# Altium project Customized Battery Management System - Load Sharing.PrjPcb
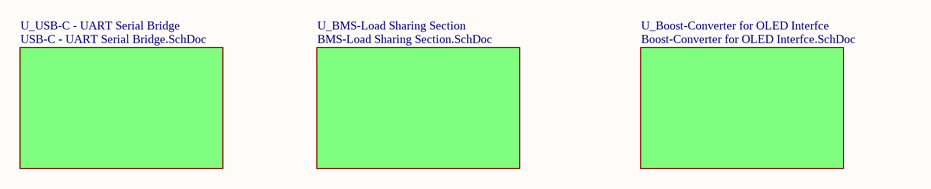
[diagram p0: Customized Battery Management System - Load Sharing System.SchDoc]
5 sheets, 33 parts. Net scope: global (net labels, ports and power ports of the same name join across sheets).
Board file: Customized Battery Management System - Load Sharing System.PcbDoc
Sheets:
  Customized Battery Management System - Load Sharing System.SchDoc
    U_BMS-Load Sharing Section = BMS-Load Sharing Section.SchDoc
    U_USB-C - UART Serial Bridge = USB-C - UART Serial Bridge.SchDoc
    U_Boost-Converter for OLED Interfce = Boost-Converter for OLED Interfce.SchDoc
  Funtional Block Diagram Power Section.SchDoc

## Sheet Customized Battery Management System - Load Sharing System.SchDoc
size A4; SheetNumber: 1; SheetTotal: 5

### Sub-sheets
U_BMS-Load Sharing Section = BMS-Load Sharing Section.SchDoc: no entries
U_Boost-Converter for OLED Interfce = Boost-Converter for OLED Interfce.SchDoc: no entries
U_USB-C - UART Serial Bridge = USB-C - UART Serial Bridge.SchDoc: no entries

## Sheet BMS-Load Sharing Section.SchDoc
size A4; SheetNumber: 3; SheetTotal: 5
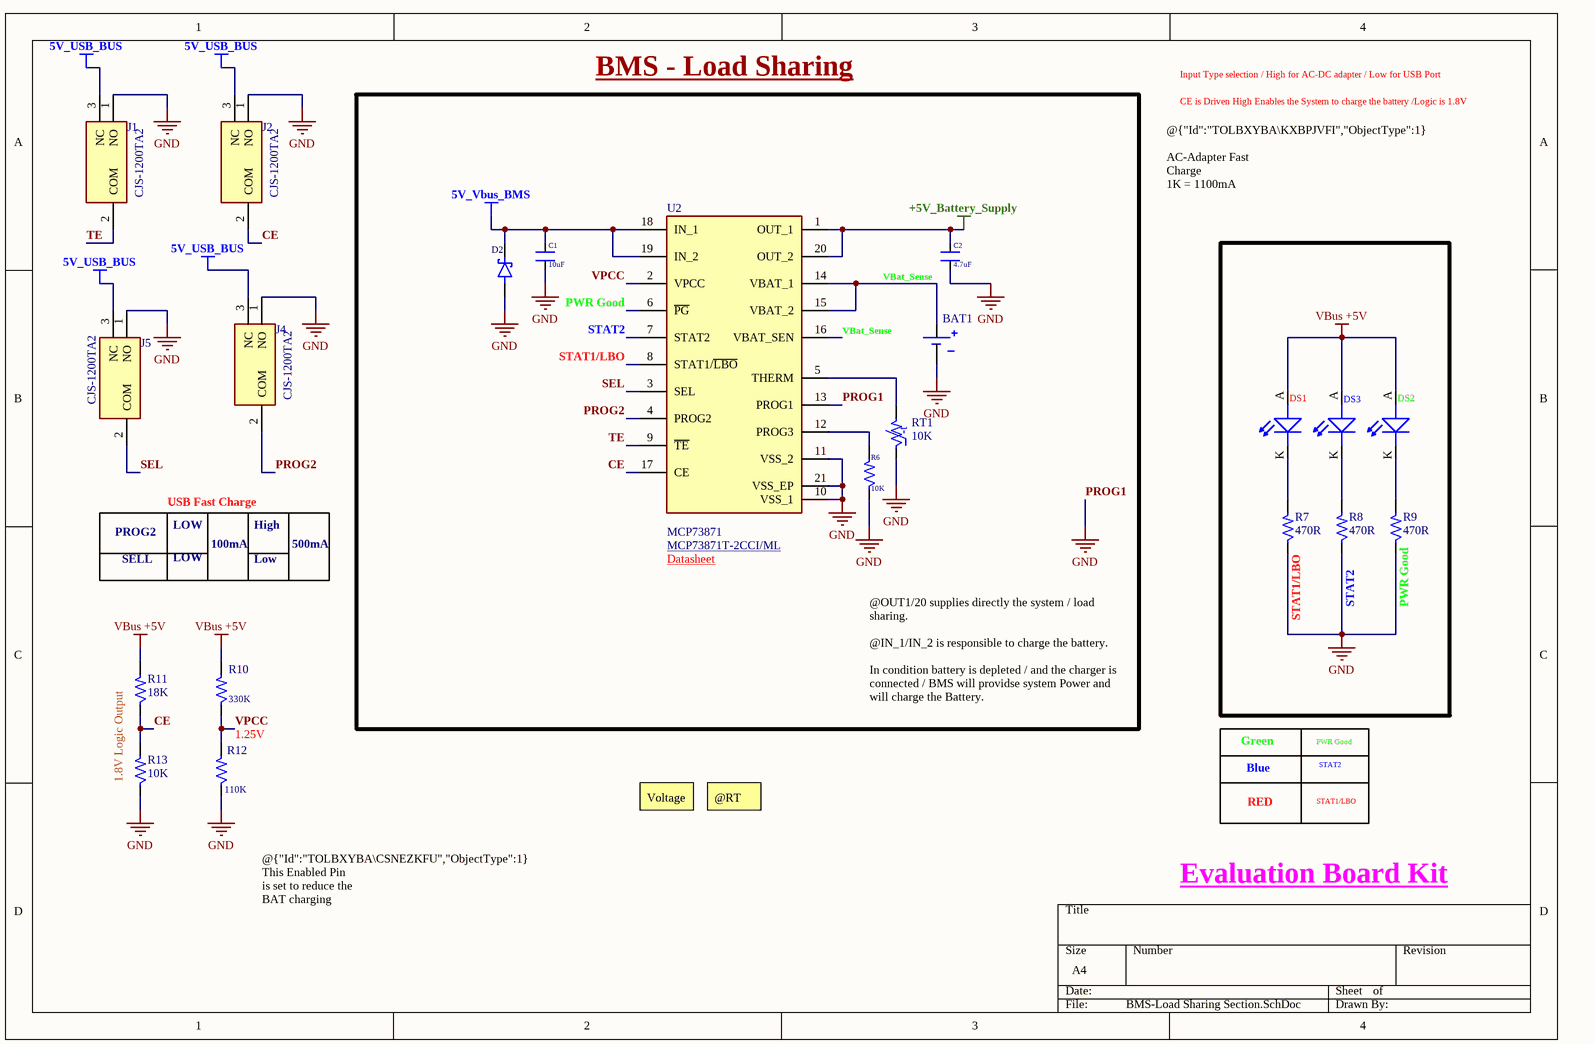
[diagram p1: BMS-Load Sharing Section.SchDoc]

### Parts
BAT1  COM-2292  [BAT_761_TH]  (value not drawn)
C1  10uF  [RES_0603]
C2  4.7uF  [RES_0603]
D2  (no value)  [SMC (DO-214AB)]
DS1  RED  [LED_0805]
DS2  GREEN LED  [LED_0805]  (value not drawn)
DS3  BLUE LED  [LED_0805]  (value not drawn)
J1  CJS-1200TA2  [CJS1200TA2]
J2  CJS-1200TA2  [CJS1200TA2]
J4  CJS-1200TA2  [CJS1200TA2]
J5  CJS-1200TA2  [CJS1200TA2]
R6  10K  [RES_0603]
R7  470R  [RES_0805]
R8  470R  [RES_0805]
R9  470R  [RES_0805]
R10  330K  [RES_0603]
R11  18K  [RES_0805]
R12  110K  [RES_0603]
R13  10K  [RES_0603]
RT1  10K  [RES_0805]
U2  MCP73871  [QFN50P400X400X100-21N-D]

### Blocks framed on the sheet
BMS - Load Sharing: BAT1 C1 C2 D2 R6 RT1 U2

### Nets
5V_USB_BUS: J1.3(NC) J2.3(NC) J4.3(NC) J5.3(NC)
5V_Vbus_BMS: C1.2 D2.C(K) U2.18(IN_1) U2.19(IN_2)
+5V_Battery_Supply: C2.2 U2.1(OUT_1) U2.20(OUT_2)
GND: BAT1.2(NEG) C1.1 C2.1 D2.A J1.1(NO) J2.1(NO) J4.1(NO) J5.1(NO) R6.1 R7.1 R8.1 R9.1 R12.1 R13.1 RT1.1 U2.6(~{PG}) U2.7(STAT2) U2.8(STAT1/~{LBO}) U2.10(VSS_1) U2.11(VSS_2) U2.13(PROG1) U2.21(VSS_EP)  [also labelled PROG1, PWR Good, STAT1/LBO, STAT2]
VBus +5V: DS1.A(ANODE) DS2.A(ANODE) DS3.A(ANODE) R10.2 R11.2
CE: J2.2(COM) R11.1 R13.2 U2.17(CE)
PROG2: J4.2(COM) U2.4(PROG2)
SEL: J5.2(COM) U2.3(SEL)
TE: J1.2(COM) U2.9(~{TE})
VBat_Sense: BAT1.1(POS) U2.14(VBAT_1) U2.15(VBAT_2) U2.16(VBAT_SEN)
VPCC: R10.1 R12.2 U2.2(VPCC)
NetDS1_K: DS1.K(CATHODE) R7.2
NetDS2_K: DS2.K(CATHODE) R9.2
NetDS3_K: DS3.K(CATHODE) R8.2
NetR6_2: R6.2 U2.12(PROG3)
NetRT1_2: RT1.2 U2.5(THERM)

### Notes on the sheet
- Input Type selection / High for AC-DC adapter / Low for USB Port
- CE is Driven High Enables the System to charge the battery /Logic is 1.8V
- @{"Id":"TOLBXYBA\KXBPJVFI","ObjectType":1}
  AC-Adapter Fast Charge
  1K = 1100mA
  10K = 110mA
- USB Fast Charge
- LOW
- High
- PROG2
- SELL
- 100mA
- Low
- 500mA
- Datasheet <https://ww1.microchip.com/downloads/en/DeviceDoc/MCP73871-Data-Sheet-20002090E.pdf>
- (near U2) MCP73871T-2CCI/ML <https://au.mouser.com/ProductDetail/Microchip-Technology/MCP73871T-2CCI-ML?qs=qXsUupcbpXwuQ8z0ISUvDA%3D%3D>
- @OUT1/20 supplies directly the system / load sharing.
  @IN_1/IN_2 is responsible to charge the battery.
  In condition battery is depleted / and the charger is connected / BMS will providse system Power and will charge the Battery.
- 1.8V Logic Output
- 1.25V
- Green
- Blue
- PWR Good
- STAT2
- Voltage Proportional Charge
  Control (VPCC)
  If the voltage on the IN pin drops to a preset value
  determined by the threshold established at the VPCC
  input due to a limited amount of input current or input
  source impedance, the battery charging current is
  reduced. If possible, further demand from the system is
  supported by the battery. To enable this feature, simply
  supply 1.23V or greater to the VPCC pin. This feature
  can be disabled by connecting the VPCC pin to IN.
  For example, a system is designed with a 5.5V rated
  DC power supply with ±0.5V tolerance. The worst
  condition of 5V is selected, which is used to calculate
  the VPCC supply voltage with divider.
- @RT THERM
  The MCP73871 device continuously monitors battery
  temperature during a charge cycle by measuring the
  voltage between the THERM and VSS pins. An internal
  50 μA current source provides the bias for most
  common 10 k NTC or Positive Temperature Coefficient (PTC) thermistors.The current source is
  controlled, avoiding measurement sensitivity to fluctuations in the supply voltage (VDD). The MCP73871
  device compares the voltage at the THERM pin to factory set thresholds of 1.24V and 0.25V, typically. Once
  a voltage outside the thresholds is detected during a
  charge cycle, the MCP73871 device immediately
  suspends the charge cycle.
- STAT1/LBO
- @{"Id":"TOLBXYBA\CSNEZKFU","ObjectType":1}
  This Enabled Pin is set to reduce the BAT charging when the Input impedance is high so the source current is prioritized for the System Load.
- Evaluation Board Kit <https://ww1.microchip.com/downloads/aemDocuments/documents/OTH/ProductDocuments/UserGuides/51755a.pdf>
- (in symbol RT_10K-0805) -t

### Library data of the parts
BAT1 = BAT_787-TH: Basic 20mm coin cell holder. Posts can be inserted into 0.1" perf board! Holds the common CR2032 type batteries.; Manufacturer: NA; Manufacturer Part Number: NA; Case/Package: TH; Supplier-1: Rhydo Labs; Supplier Part Number-1: COM-2292; Alternate Part Number-1: NA
C1 C2 = CAP_GENERIC_0603_1: Ceramic Capacitor C0G, NP0 0603 (2012 Metric); Manufacturer: Yageo; Manufacturer Part Number: 600F1R0BT250XT; Alternate Part Number-1: NA; Case/Package: 0805; Supplier-1: Mouser; Supplier Part Number-1: 581-600F1R0BT
D2 = DIO - Diode Schottky 40 V 3A Surface Mount SMC (DO-214AB)  SS34: Diode Schottky 40 V 3A Surface Mount SMC (DO-214AB)
DS1 = LED_RED-2V-20mA-0805: Red 631nm LED Indication - Discrete 2V 0805 (2012 Metric); Manufacturer: Vishay Lite-On; Manufacturer Part Number: LTST-C171KRKT; Alternate Part Number-1: NA; Case/Package: 0805; Supplier-1: SP ROAD; Supplier Part Number-1: LTST-C171KRKT
DS2 = LED_GREEN-2.2-20mA-0805: Green 569nm LED Indication - Discrete 2.1V 0805 (2012 Metric); Manufacturer: Vishay Lite-On; Manufacturer Part Number: LTST-C171GKT; Alternate Part Number-1: NA; Case/Package: 0805; Supplier-1: SP ROAD; Supplier Part Number-1: LTST-C171GKT
DS3 = LED_BLUE-3V3-20mA-0805: Blue 470nm LED Indication - Discrete 3.3V 0805 (2012 Metric); Manufacturer: Vishay Lite-On; Manufacturer Part Number: LTST-C171TBKT; Alternate Part Number-1: NA; Case/Package: 0805; Supplier-1: SP ROAD; Supplier Part Number-1: LTST-C171TBKT
J1 J2 J4 J5 = Switches Slide 1 Pole, 2 Contacts, SPDT Top Setting SMD Slide Switch: Slide Switches 1 Pole, 2 Contacts, SPDT Top Setting SMD Slide Switch
R6 R10 R12 R13 = RES_10K-0.1W-1%-0603: 10 kOhms ±1% 0.1W, 1/10W Chip Resistor 0603 (1608 Metric) Automotive AEC-Q200 Thick Film; Manufacturer: Walsin; Manufacturer Part Number: WR06X1002FTL; Alternate Part Number-1: 0603WAJ0103T5E; Case/Package: 0603; Supplier-1: SIRICOM; Supplier Part Number-1: WR06X1002FTL
R7-R9 = RES_470R-0.125W-1%-0805: 470 Ohms ±1% 0.125W, 1/8W Chip Resistor 0805 (2012 Metric) Automotive AEC-Q200 Thick Film; Manufacturer: Walsin; Manufacturer Part Number: WR08X4700FTL; Alternate Part Number-1: NA; Case/Package: 0805; Supplier-1: SIRICOM; Supplier Part Number-1: WR08X4700FTL
R11 = RES_18K-0.125W-1%-0805: 18 kOhms ±1% 0.125W, 1/8W Chip Resistor 0805 (2012 Metric) Thick Film; Manufacturer: TE Connectivity Passive Product; Manufacturer Part Number: CRG0805F18K; Alternate Part Number-1: NA; Case/Package: 0805; Supplier-1: SIRICOM; Supplier Part Number: NA; Supplier Part Number-1: NA
RT1 = RT_10K-0805: NTC Thermistor 10k 0805 (2012 Metric); Manufacturer: Vishay BCcomponents; Manufacturer Part Number: NCP21XV103J03RA; Alternate Part Number-1: NA; Case/Package: 0805; Supplier-1: ARROW; Supplier Part Number-1: NCP21XV103J03RA
U2 = IC-MCP73871 Battery Management System: Stand-Alone System Load Sharing and Li-Ion/Li-Polymer Battery Charge / Management Controller

## Sheet USB-C - UART Serial Bridge.SchDoc
size A4; SheetNumber: 2; SheetTotal: 5
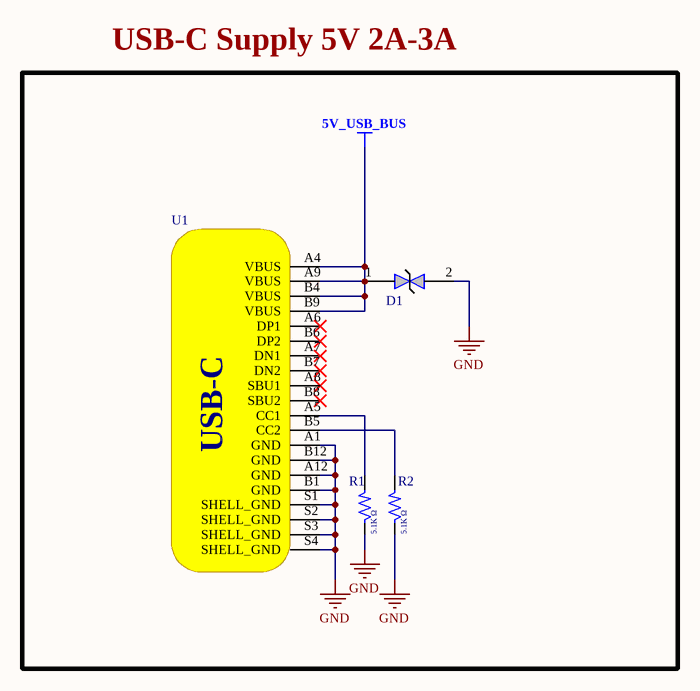
[diagram p2: USB-C - UART Serial Bridge.SchDoc]

### Parts
D1  PESD3V3L1BA,  [Nexperia_SOD323_0]  (value not drawn)
R1  5.1K Ω  [RES_0603]
R2  5.1K Ω  [RES_0603]
U1  C393939  [USB-C 16Pin]  (value not drawn)

### Blocks framed on the sheet
USB-C Supply 5V 2A-3A: D1 R1 R2 U1

### Nets
5V_USB_BUS: D1.1 U1.A4(VBUS) U1.A9(VBUS) U1.B4(VBUS) U1.B9(VBUS)
GND: D1.2 R1.1 R2.1 U1.A1(GND) U1.A12(GND) U1.B1(GND) U1.B12(GND) U1.S1(SHELL_GND) U1.S2(SHELL_GND) U1.S3(SHELL_GND) U1.S4(SHELL_GND)
NetR1_2: R1.2 U1.A5(CC1)
NetR2_2: R2.2 U1.B5(CC2)

Not connected (* = marked no-connect by the designer): U1 A6(DP1)* A7(DN1)* A8(SBU1)* B6(DP2)* B7(DN2)* B8(SBU2)*

### Notes on the sheet
- (in symbol USB-C 16Pin) USB-C

### Library data of the parts
D1 = DIO_TVS_PESD3V3L1BA,115
R1 R2 = RES_82K-0.1W-1%-0603: 82 kOhms ±1% 0.125W, 1/8W Chip Resistor 0603 (1608 Metric) Anti-Sulfur Thin Film; Manufacturer: Vishay Beyschlag; Manufacturer Part Number: MCT06030C8202FP500; Alternate Part Number-1: NA; Case/Package: 0603; Supplier-1: SIRICOM; Supplier Part Number-1: NA
U1 = USB-C 16Pin: USB-C (USB TYPE-C) Receptacle Connector 16 Position Surface Mount, Right Angle; Manufacturer: SHOU HAN; Manufacturer PN: N/A; Supplier  PN: C393939; Supplier: LCSC

## Sheet Boost-Converter for OLED Interfce.SchDoc
size A4; SheetNumber: 4; SheetTotal: 5
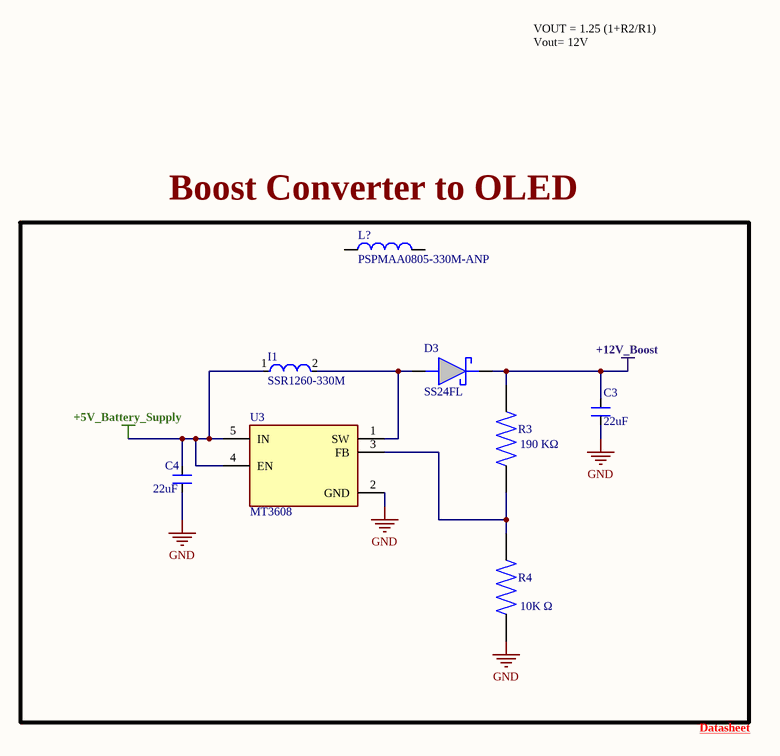
[diagram p3: Boost-Converter for OLED Interfce.SchDoc]

### Parts
C3  22uF  [RES_0603]
C4  22uF  [RES_0603]
D3  SS24FL  [Diode SS24FL]
I1  SSR1260-330M  [IND_33uH_60m_Ohm_3A]
L?  PSPMAA0805-330M-ANP  [IND 8.5x8mm]
R3  ERJU03J106V  [RES 0603 Panasonic]  (value not drawn)
R4  ERJU03J106V  [RES 0603 Panasonic]  (value not drawn)
U3  MT3608  [SOT95P280X145-6N]

### Nets
+5V_Battery_Supply: C4.2 I1.1 U3.4(EN) U3.5(IN)
+12V_Boost: C3.2 D3.C R3.2
GND: C3.1 C4.1 R4.1 U3.2(GND)
NetD3_A: D3.A I1.2 U3.1(SW)
NetR3_1: R3.1 R4.2 U3.3(FB)

Not connected (* = marked no-connect by the designer): L? 1 2

### Notes on the sheet
- VOUT = 1.25 (1+R2/R1)
  Vout= 12V
- (near R3) 190 KΩ
- (near R4) 10K Ω
- Datasheet <https://www.lcsc.com/datasheet/C84817.pdf>
- Labels drawn without touching a wire or pin: Boost Converter to OLED

### Library data of the parts
C3 C4 = CAP_GENERIC_0603_1: as C1 on sheet BMS-Load Sharing Section; Case/Package: 0805; Supplier-1: Mouser; Supplier Part Number-1: 581-600F1R0BT
D3 = DIO - Schottky Diodes & Rectifiers 40V 2A: Schottky Diodes & Rectifiers 40V, 2A SCHOTTKY
I1 = IND_33uH_60m_Ohm_3A: IND FIXED IND 33UH 3A 60 MOHM SMD; Manufacturer: BOURNS; Manufacturer  PN: SRR1260-330M; Supplier: LCSC; Supplier  PN: C840528
L? = IND-33uH 111m Ohm 6A: 3.5A 33uH 111mΩ 6A ±20% SMD,8.5x8mm Fixed Inductors RoHS
R3 R4 = RES 0603 Panasonic: 0201 anti-sulfurated resistor 0603 Anti-Sulfurated
U3 = IC- Dc-Dc Boost converter: The MT3608 is a constant frequency, 6-pin SOT23 / current mode step-up converter intended for small, / low power applications.; Manufacturer: AEROSEMI; Manufacturer  PN: MT3608; Supplier: LCSC; Supplier  PN: C84817

## Sheet Funtional Block Diagram Power Section.SchDoc
size A4; SheetNumber: 5; SheetTotal: 5
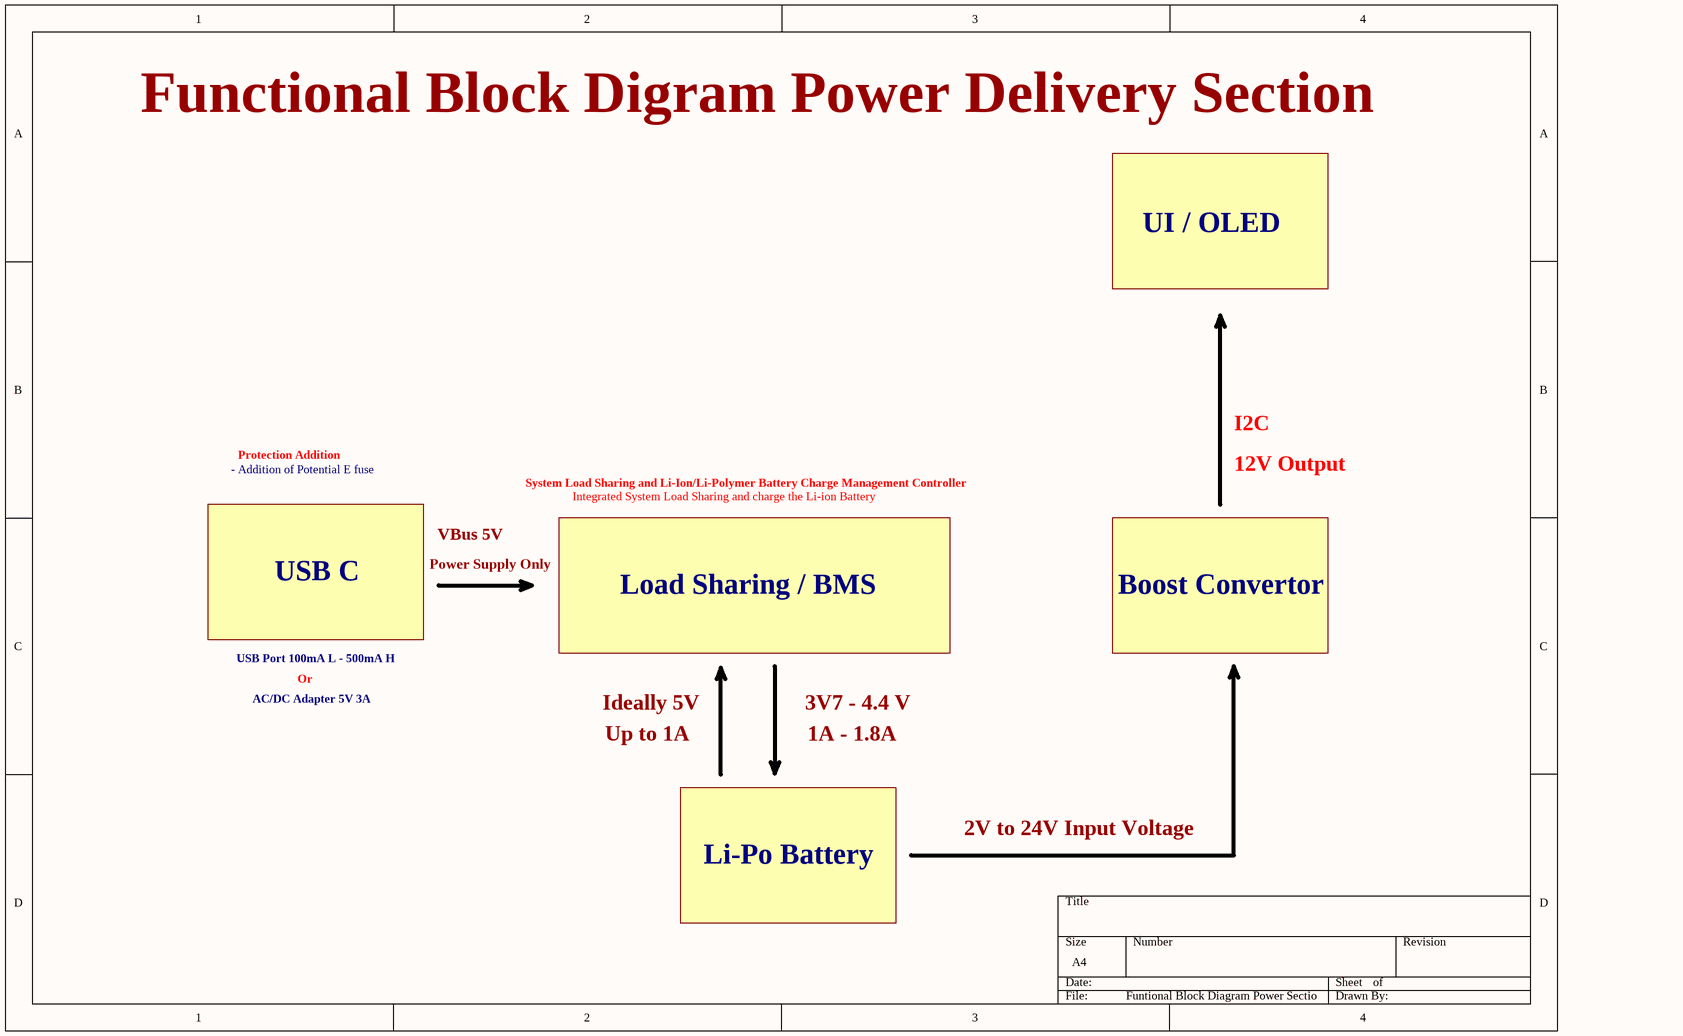
[diagram p4: Funtional Block Diagram Power Section.SchDoc]

### Notes on the sheet
- Functional Block Digram Power Delivery Section
- UI / OLED
- I2C
- - Addition of Potential E fuse
- Protection Addition
- System Load Sharing and Li-Ion/Li-Polymer Battery Charge Management Controller
- Integrated System Load Sharing and charge the Li-ion Battery
- 12V Output
- USB C
- Power Supply Only
- VBus 5V
- Load Sharing / BMS
- Boost Convertor
- USB Port 100mA L - 500mA H
- AC/DC Adapter 5V 3A
- Or
- Ideally 5V
- 3V7 - 4.4 V
- Up to 1A
- 1A - 1.8A
- 2V to 24V Input Voltage
- Li-Po Battery

## Nets that join several sheets
5V_USB_BUS: BMS-Load Sharing Section (J1.3 J2.3 J4.3 J5.3), USB-C - UART Serial Bridge (5 pins)
+5V_Battery_Supply: BMS-Load Sharing Section (C2.2 U2.1 U2.20), Boost-Converter for OLED Interfce (C4.2 I1.1 U3.4 U3.5)
GND: BMS-Load Sharing Section (22 pins), USB-C - UART Serial Bridge (11 pins), Boost-Converter for OLED Interfce (C3.1 C4.1 R4.1 U3.2)